# Altium schematic sheet PSU.SchDoc
size A4; DrawnBy: Jakov Sola; SheetNumber: 6; SheetTotal: 6
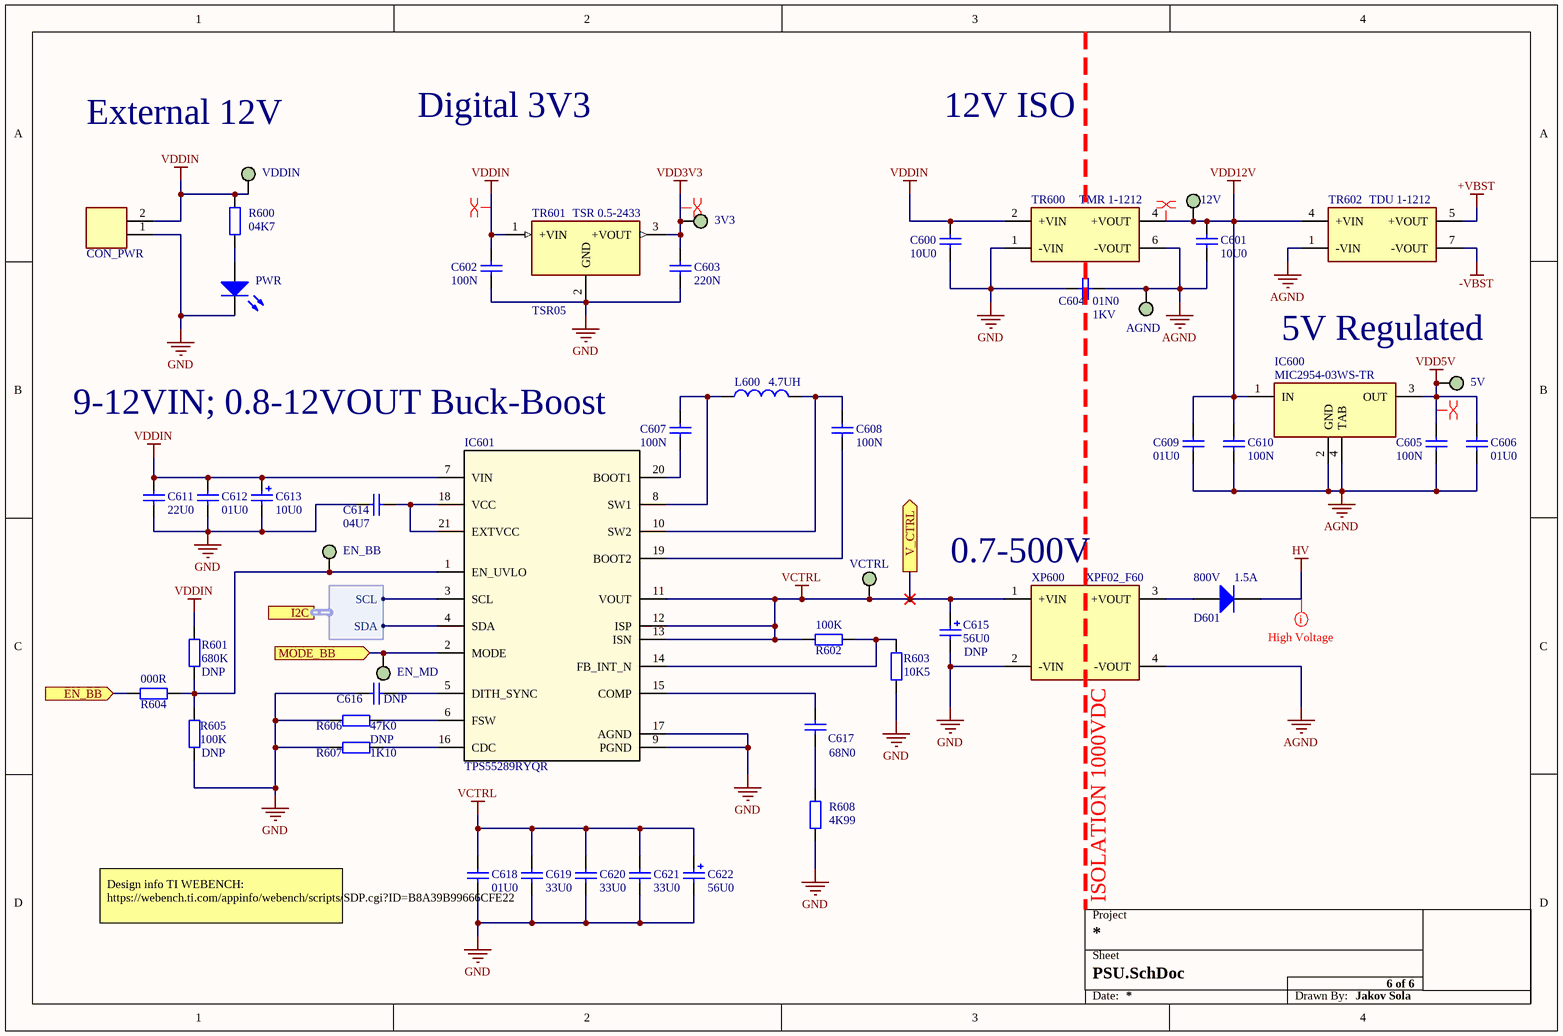
[diagram p0: PSU.SchDoc]

## Parts
3V3  TP  [TP]  (value not drawn)
5V  TP  [TP]  (value not drawn)
12V  TP  [TP]  (value not drawn)
AGND  TP  [TP]  (value not drawn)
C600  VALUE_4C: 10U0  [CAPC0603N]  (hidden comment: Cap)
C601  VALUE_4C: 10U0  [CAPC0603N]  (hidden comment: Cap)
C602  VALUE_4C: 100N  [CAPC0603N]  (hidden comment: Cap)
C603  VALUE_4C: 220N  [CAPC0603N]  (hidden comment: Cap)
C604  VALUE_4C: 01N0  VOLTAGE: 1KV  [CAPC1206N]  (hidden comment: Cap)
C605  VALUE_4C: 100N  [CAPC0603N]  (hidden comment: Cap)
C606  VALUE_4C: 01U0  [CAPC0603N]  (hidden comment: Cap)
C607  VALUE_4C: 100N  [CAPC0603N]  (hidden comment: Cap)
C608  VALUE_4C: 100N  [CAPC0603N]  (hidden comment: Cap)
C609  VALUE_4C: 01U0  [CAPC0603N]  (hidden comment: Cap)
C610  VALUE_4C: 100N  [CAPC0603N]  (hidden comment: Cap)
C611  VALUE_4C: 22U0  [CAPC1206N]  (hidden comment: Cap)
C612  VALUE_4C: 01U0  [CAPC0603N]  (hidden comment: Cap)
C613  VALUE_4C: 10U0  [C]  (hidden comment: CapPol)
C614  VALUE_4C: 04U7  [CAPC0603N]  (hidden comment: Cap)
C615  POPULATE: DNP  VALUE_4C: 56U0  [20SVPF56MX]  (hidden comment: CapPol)
C616  POPULATE: DNP  [CAPC0603N]  (hidden comment: Cap)
C617  VALUE_4C: 68N0  [CAPC0603N]  (hidden comment: Cap)
C618  VALUE_4C: 01U0  [CAPC0603N]  (hidden comment: Cap)
C619  VALUE_4C: 33U0  [CAPC1206N]  (hidden comment: Cap)
C620  VALUE_4C: 33U0  [CAPC1206N]  (hidden comment: Cap)
C621  VALUE_4C: 33U0  [CAPC1206N]  (hidden comment: Cap)
C622  VALUE_4C: 56U0  [20SVPF56MX]  (hidden comment: CapPol)
CON_PWR  CON_2P  [1711725]  (value not drawn)
D601  IF: 1.5A  VR: 800V  [DIOSMB]  (hidden comment: Diode)
EN_BB  TP  [TP]  (value not drawn)
EN_MD  TP  [TP]  (value not drawn)
IC600  MIC2954-03WS-TR  [SOT230P700X180-4N]
IC601  TPS55289RYQR  [RYQ0021A-MFG]
L600  INDUCTANCE: 4.7UH  [SRN80404R7Y]  (hidden comment: Inductor)
PWR  LED  [LED0603_GREEN]  (value not drawn)
R600  VALUE_4C: 04K7  [RESC0603N]  (hidden comment: Res)
R601  POPULATE: DNP  VALUE_4C: 680K  [RESC0603N]  (hidden comment: Res)
R602  VALUE_4C: 100K  [RESC0603N]  (hidden comment: Res)
R603  VALUE_4C: 10K5  [RESC0603N]  (hidden comment: Res)
R604  VALUE_4C: 000R  [RESC0603N]  (hidden comment: Res)
R605  POPULATE: DNP  VALUE_4C: 100K  [RESC0603N]  (hidden comment: Res)
R606  VALUE_4C: 47K0  [RESC0603N]  (hidden comment: Res)
R607  POPULATE: DNP  VALUE_4C: 1K10  [RESC0603N]  (hidden comment: Res)
R608  VALUE_4C: 4K99  [RESC0603N]  (hidden comment: Res)
TR600  MANUFCODE: TMR 1-1212  [TMR1]  (hidden comment: TMR1)
TR601  TSR05  MANUFCODE: TSR 0.5-2433  [TSR05]
TR602  MANUFCODE: TDU 1-1212  [TDU1]  (hidden comment: TDU1)
VCTRL  TP  [TP]  (value not drawn)
VDDIN  TP  [TP]  (value not drawn)
XP600  XPF02_F60  [XPF02_F60]

## Ports
EN_BB (in), I2C (harness I2C), MODE_BB (in), V_CTRL (out)

## Harnesses
I2C: SCL, SDA

## Nets
+VBST: TR602.5(+VOUT)
-VBST: TR602.7(-VOUT)
AGND: AGND.TP C601.1 C604.2 C605.1 C606.1 C609.1 C610.1 IC600.2(GND) IC600.4(TAB) TR600.6(-VOUT) TR602.1(-VIN) XP600.4(-VOUT)
GND: C600.1 C602.1 C603.1 C604.1 C611.1 C612.1 C613.2 C614.1 C615.2 C616.2 C618.1 C619.1 C620.1 C621.1 C622.2 CON_PWR.1 IC601.9(PGND) IC601.17(AGND) PWR.2(K) R603.2 R605.1 R606.2 R607.1 R608.1 TR600.1(-VIN) TR601.2(GND) XP600.2(-VIN)
HV: D601.2(K)
VCTRL: C615.1 C618.2 C619.2 C620.2 C621.2 C622.1 IC601.11(VOUT) IC601.12(ISP) IC601.13(ISN) R602.1 VCTRL.TP XP600.1(+VIN) ; port V_CTRL
VDD3V3: 3V3.TP C603.2 TR601.3(+VOUT)
VDD5V: 5V.TP C605.2 C606.2 IC600.3(OUT)
VDD12V: 12V.TP C601.2 C609.2 C610.2 IC600.1(IN) TR600.4(+VOUT) TR602.4(+VIN)
VDDIN: C600.2 C602.2 C611.2 C612.2 C613.1 CON_PWR.2 IC601.7(VIN) R600.2 R601.2 TR600.2(+VIN) TR601.1(+VIN) VDDIN.TP
EN_BB: R604.1 ; port EN_BB
MODE_BB: EN_MD.TP IC601.2(MODE) ; port MODE_BB
NetC607_1: C607.1 IC601.20(BOOT1)
NetC607_2: C607.2 IC601.8(SW1) L600.1
NetC608_1: C608.1 IC601.19(BOOT2)
NetC608_2: C608.2 IC601.10(SW2) L600.2
NetC614_2: C614.2 IC601.18(VCC) IC601.21(EXTVCC)
NetC616_1: C616.1 IC601.5(DITH_SYNC)
NetC617_1: C617.1 R608.2
NetC617_2: C617.2 IC601.15(COMP)
NetD601_1: D601.1(A) XP600.3(+VOUT)
NetEN_BB_TP: EN_BB.TP IC601.1(EN_UVLO) R601.1 R604.2 R605.2
NetIC601_3: IC601.3(SCL) ; port I2C.SCL
NetIC601_4: IC601.4(SDA) ; port I2C.SDA
NetIC601_6: IC601.6(FSW) R606.1
NetIC601_14: IC601.14(FB_INT_N) R602.2 R603.1
NetIC601_16: IC601.16(CDC) R607.2
NetPWR_1: PWR.1(A) R600.1

## Layout directives
mark named High Voltage: HV
rule Supply Nets [Voltage = 3.300]: VDD3V3, VDD5V
rule Supply Nets [Voltage = 12.00]: VDDIN
rule Supply Nets [Voltage = 5.000]: VDD12V

## Notes on the sheet
- External 12V
- Digital 3V3
- 12V ISO
- 5V Regulated
- 9-12VIN; 0.8-12VOUT Buck-Boost
- (near XP600) 0.7-500V
- Design info TI WEBENCH:
  https://webench.ti.com/appinfo/webench/scripts/SDP.cgi?ID=B8A39B99666CFE22
- (near XP600) ISOLATION 1000VDC
- Project
- Sheet
- Date:
- Drawn By:

## Library data of the parts
3V3 5V 12V AGND EN_BB EN_MD VCTRL VDDIN = TP: DESCR: TESTPOINT 1.5MM; POPULATE: NA; MANUFCODE: TP
C600 C601 = ZRB18AR61E106ME01L: MANUF: MURATA; DESCR: CAP 10U0 0603 25V X5R 20%; VENDOR: FARNELL INONE; VENDORCODE: 2469398; POPULATE: YES; VALUE_PF: 10000000; VALUE: 10U; VOLTAGE: 25V; TOLERANCE: 0.2; MANUFCODE: ZRB18AR61E106ME01L; PACKAGE: 0603; TECHNOLOGY: X5R
C602 C605 C607 C608 C610 = CL10B104KA8WPNC: MANUF: SAMSUNG; DESCR: CAP 100N 0603 25V X7R 10%; VENDOR: DIGI-KEY; VENDORCODE: 1276-6717-1-ND; POPULATE: YES; VALUE: 100N; VOLTAGE: 25V; TOLERANCE: 0.1; MANUFCODE: CL10B104KA8WPNC; PACKAGE: 0603; TECHNOLOGY: X7R
C603 = AC0603KRX7R6BB224: MANUF: YAGEO; DESCR: CAP 220N 0603 10V X7R 10%; VENDOR: DIGI-KEY; VENDORCODE: 311-3103-1-ND; POPULATE: YES; VALUE: 220N; VOLTAGE: 10V; TOLERANCE: 0.1; MANUFCODE: AC0603KRX7R6BB224; PACKAGE: 0603; TECHNOLOGY: X7R
C604 = 1206AC102KAT2A: MANUF: AVX; DESCR: CAP 01N0 1206 1KV X7R 10%; VENDOR: FARNELL INONE; VENDORCODE: 1216463; POPULATE: YES; VALUE_PF: 1000; TOLERANCE: 0.1; MANUFCODE: 1206AC102KAT2A; PACKAGE: 1206; TECHNOLOGY: X7R
C606 C609 = C0603C105K4PAC-TU: MANUF: KEMET; DESCR: CAP 01U0 0603 16V X5R 10%; VENDOR: FARNELL INONE; VENDORCODE: 1463388; POPULATE: YES; VALUE_PF: 1000000; VOLTAGE: 16V; TOLERANCE: 0.1; MANUFCODE: C0603C105K4PAC-TU; PACKAGE: 0603; TECHNOLOGY: X5R
C611 = CL31A226KAHNNNE: MANUF: SAMSUNG; DESCR: CAP 22U0 1206 25V X5R 10%; VENDOR: MOUSER; VENDORCODE: 187-CL31A226KAHNNNE; POPULATE: YES; VALUE_PF: 22000000; VALUE: 22U0; VOLTAGE: 25V; TOLERANCE: 0.1; MANUFCODE: CL31A226KAHNNNE; PACKAGE: 1206; TECHNOLOGY: X5R
C612 C618 = C0603C105K3PAC: MANUF: KEMET; DESCR: CAP 01U0 0603 25V X5R 10%; VENDOR: FARNELL INONE; VENDORCODE: 1288202; POPULATE: YES; VALUE_PF: 1000000; VOLTAGE: 25V; TOLERANCE: 0.1; MANUFCODE: C0603C105K3PAC; PACKAGE: 0603; TECHNOLOGY: X5R
C613 = TAJC106K025RNJ: MANUF: AVX; DESCR: CAP 10U0 C 25V TANT 10%; VENDOR: FARNELL INONE; VENDORCODE: 197518; POPULATE: YES; VALUE_PF: 10000000; VALUE: 10U; VOLTAGE: 25V; TOLERANCE: 0.1; MANUFCODE: TAJC106K025RNJ; PACKAGE: C; TECHNOLOGY: TANT
C614 = GRM185R61C475KE11D: MANUF: MURATA; DESCR: CAP 04U7 0603 16V X5R 10%; VENDOR: DIGI-KEY; VENDORCODE: 490-14459-1-ND; POPULATE: YES; VALUE_PF: 4700000; VALUE: 04U7; VOLTAGE: 16V; TOLERANCE: 0.1; MANUFCODE: GRM185R61C475KE11D; PACKAGE: 603; TECHNOLOGY: X5R
C615 = 20SVPF56MX: MANUF: PANASONIC; DESCR: CAP 56U0 5X5.9 20V 20%; VENDOR: MOUSER; VENDORCODE: 667-20SVPF56MX; VALUE_PF: 56000000; VALUE: 56U; VOLTAGE: 20V; TOLERANCE: 0.2; MANUFCODE: 20SVPF56MX; PACKAGE: 5X5.9
C616 = C0603C105K3PAC: MANUF: KEMET; DESCR: CAP 01U0 0603 25V X5R 10%; VENDOR: FARNELL INONE; VENDORCODE: 1288202; VALUE_PF: 1000000; VALUE_4C: 01U0; VOLTAGE: 25V; TOLERANCE: 0.1; MANUFCODE: C0603C105K3PAC; PACKAGE: 0603; TECHNOLOGY: X5R
C617 = C0603C683K8RACTU: MANUF: KEMET; DESCR: CAP 68N0 0603 10V X7R 10%; VENDOR: DIGI-KEY; VENDORCODE: 399-9122-1-ND; POPULATE: YES; VALUE: 68N; VOLTAGE: 10V; TOLERANCE: 0.1; MANUFCODE: C0603C683K8RACTU; PACKAGE: 0603; TECHNOLOGY: X7R
C619-C621 = C3216X5R1E336M160AC: MANUF: TDK; DESCR: CAP 33U0 1206 25V X5R 20%; VENDOR: MOUSER; VENDORCODE: 810-C3216X5R1E336M; POPULATE: YES; VALUE_PF: 33000000; VALUE: 33U; VOLTAGE: 25V; TOLERANCE: 0.2; MANUFCODE: C3216X5R1E336M160AC; PACKAGE: 1206; TECHNOLOGY: X5R
C622 = 20SVPF56MX: MANUF: PANASONIC; DESCR: CAP 56U0 5X5.9 20V 20%; VENDOR: MOUSER; VENDORCODE: 667-20SVPF56MX; POPULATE: YES; VALUE_PF: 56000000; VALUE: 56U; VOLTAGE: 20V; TOLERANCE: 0.2; MANUFCODE: 20SVPF56MX; PACKAGE: 5X5.9
CON_PWR = 1711725: MANUF: PHOENIX CONTACT; DESCR: CON PHOENIX 5.08MM 2P SCREW; VENDOR: MOUSER; VENDORCODE: 651-1711725; POPULATE: YES; MANUFCODE: 1711725
D601 = RS2K-E3/52T: Default Diode; MANUF: VISHAY; DESCR: DIODE 800V 1.5A SMB; VENDOR: MOUSER; VENDORCODE: 625-RS2K-E3; POPULATE: YES; MANUFCODE: RS2K-E3/52T; QTY: SINGLE; PACKAGE: SMB
IC600 = MIC2954-03WS-TR: MANUF: MICROCHIP; DESCR: IC LDO 2-30VIN 5VOUT 250mA; VENDOR: MOUSER; VENDORCODE: 998-MIC2954-03WSTR; POPULATE: YES; MANUFCODE: MIC2954-03WS-TR
IC601 = TPS55289RYQR: MANUF: TI; DESCR: IC BUCK-BOOST 30V 8A I2C; VENDOR: MOUSER; VENDORCODE: 595-TPS55289RYQR; POPULATE: YES; MANUFCODE: TPS55289RYQR
L600 = SRN8040-4R7Y: MANUF: BOURNS; DESCR: INDUCTOR 04U7 4A1 R024 SMD; VENDOR: MOUSER; VENDORCODE: 652-SRN8040-4R7Y; POPULATE: YES; VALUE: 04U7; IMAX: 4A1; RESISTANCE: R024; MANUFCODE: SRN8040-4R7Y; TYPE: INDUCTOR
PWR = ASMT-RF45: MANUF: AVAGO TECHNOLOGIES; DESCR: LED GREEN 0603 20MA 2.4V 60MCD; VENDOR: FARNELL INONE; VENDORCODE: 1652078; POPULATE: YES; REMARK: GREEN; IF: 20MA; VF: 2.4V; INTENSITY: 60MCD; MANUFCODE: ASMT-RF45; QTY: SINGLE; COLOR: GREEN; PACKAGE: 0603
R600 = CRCW06034K70JNEAC: Resistor; MANUF: VISHAY; DESCR: RES 04K7 0603 0.1W 5% 75V 200PPM; VENDOR: DIGI-KEY; VENDORCODE: 541-3993-1-ND; POPULATE: YES; VALUE_MOHM: 4700000; VALUE: 04K7; POWER: 0.1W; TOLERANCE: 5%; VOLTAGE: 75V; TEMPCOEFF: 200PPM; NPOWER: 0.1; NTOLERANCE: 0.05; NVOLTAGE: 75; NTEMPCOEFF: 200; MANUFCODE: CRCW06034K70JNEAC; PACKAGE: 0603; NVALUE: 4700000
R601 = CRCW0603680KFKEA: Resistor; MANUF: VISHAY; DESCR: RES 680K 0603 0.1W 1% 75V 100PPM; VENDOR: DIGI-KEY; VENDORCODE: 541-680KHCT-ND; VALUE_MOHM: 680000000; VALUE: 680K; POWER: 0.1W; TOLERANCE: 1%; VOLTAGE: 75V; TEMPCOEFF: 100PPM; NPOWER: 0.1; NTOLERANCE: 0.01; NVOLTAGE: 75; NTEMPCOEFF: 100; MANUFCODE: CRCW0603680KFKEA; PACKAGE: 0603; NVALUE: 680000000
R602 = MC 0.063W 0603 1% 100K: Resistor; MANUF: MULTICOMP; DESCR: RES 100K 0603 0.063W 1% 50V 100PPM; VENDOR: FARNELL INONE; VENDORCODE: 9330402; POPULATE: YES; VALUE_MOHM: 100000000; VALUE: 100K; POWER: 0.063W; TOLERANCE: 1%; VOLTAGE: 50V; TEMPCOEFF: 100PPM; NPOWER: 0.063; NTOLERANCE: 0.01; NVOLTAGE: 50; NTEMPCOEFF: 100; MANUFCODE: MC 0.063W 0603 1% 100K; PACKAGE: 0603; NVALUE: 100000000
R603 = MC0063W0603110K5: Resistor; MANUF: MULTICOMP; DESCR: RES 10K5 0603 0.063W 1% 50V 100PPM; VENDOR: FARNELL INONE; VENDORCODE: 2130940; POPULATE: YES; VALUE_MOHM: 10500000; VALUE: 10K5; POWER: 0.063W; TOLERANCE: 1%; VOLTAGE: 50V; TEMPCOEFF: 100PPM; NPOWER: 0.063; NTOLERANCE: 0.01; NVOLTAGE: 50; NTEMPCOEFF: 100; MANUFCODE: MC0063W0603110K5; PACKAGE: 0603; NVALUE: 10500000
R604 = CRCW06030000Z0EA: Resistor; MANUF: VISHAY; DESCR: RES 000R 0603 0.1W 1% 75V 100PPM; VENDOR: DIGI-KEY; VENDORCODE: 541-0.0GTR-ND; POPULATE: YES; VALUE_MOHM: 0; VALUE: 000R; POWER: 0.1W; TOLERANCE: 1%; VOLTAGE: 75V; TEMPCOEFF: 100PPM; NPOWER: 0.1; NTOLERANCE: 0.01; NVOLTAGE: 75; NTEMPCOEFF: 100; MANUFCODE: CRCW06030000Z0EA; PACKAGE: 0603; NVALUE: 0
R605 = MC 0.063W 0603 1% 100K: Resistor; MANUF: MULTICOMP; DESCR: RES 100K 0603 0.063W 1% 50V 100PPM; VENDOR: FARNELL INONE; VENDORCODE: 9330402; VALUE_MOHM: 100000000; VALUE: 100K; POWER: 0.063W; TOLERANCE: 1%; VOLTAGE: 50V; TEMPCOEFF: 100PPM; NPOWER: 0.063; NTOLERANCE: 0.01; NVOLTAGE: 50; NTEMPCOEFF: 100; MANUFCODE: MC 0.063W 0603 1% 100K; PACKAGE: 0603; NVALUE: 100000000
R606 = CRCW060347K0FKEA: Resistor; MANUF: VISHAY; DESCR: RES 47K0 0603 0.1W 1% 75V 100PPM; VENDOR: DIGI-KEY; VENDORCODE: 541-47.0KHCT-ND; POPULATE: YES; VALUE_MOHM: 47000000; VALUE: 47K; POWER: 0.1W; TOLERANCE: 1%; VOLTAGE: 75V; TEMPCOEFF: 100PPM; NPOWER: 0.1; NTOLERANCE: 0.01; NVOLTAGE: 75; NTEMPCOEFF: 100; MANUFCODE: CRCW060347K0FKEA; PACKAGE: 0603; NVALUE: 47000000
R607 = CRCW06031K10FKEA: Resistor; MANUF: VISHAY; DESCR: RES 1K10 0603 0.1W 1% 75V 100PPM; VENDOR: DIGI-KEY; VENDORCODE: 541-1.10KHCT-ND; VALUE_MOHM: 1100000; VALUE: 1K1; POWER: 0.1W; TOLERANCE: 1%; VOLTAGE: 75V; TEMPCOEFF: 100PPM; NPOWER: 0.1; NTOLERANCE: 0.01; NVOLTAGE: 75; NTEMPCOEFF: 100; MANUFCODE: CRCW06031K10FKEA; PACKAGE: 0603; NVALUE: 1100000
R608 = MC 0.063W 0603 1% 4K99: Resistor; MANUF: MULTICOMP; DESCR: RES 4K99 0603 0.1W 1% 50V 100PPM; VENDOR: FARNELL INONE; VENDORCODE: 1170859; POPULATE: YES; VALUE_MOHM: 4990000; VALUE: 4K99; POWER: 0.063W; TOLERANCE: 1%; VOLTAGE: 50V; TEMPCOEFF: 100PPM; NPOWER: 0.063; NTOLERANCE: 0.01; NVOLTAGE: 50; NTEMPCOEFF: 100; MANUFCODE: MC 0.063W 0603 1% 4K99; PACKAGE: 0603; NVALUE: 4990000
TR600 = TMR 1-1212: MANUF: TRACO; DESCR: IC TR 9-18 VIN 12 VOUT REG ISO 1W; VENDOR: MOUSER; VENDORCODE: 495-TMR1-1212; POPULATE: YES
TR601 = TSR 0.5-2433: MANUF: TRACO; DESCR: IC TR 4.75-32 VIN 3.3 VOUT 0.5A; VENDOR: MOUSER; VENDORCODE: 495-TSR0.5-2433; POPULATE: YES
TR602 = TDU 1-1212: MANUF: TRACO; DESCR: IC TR 10.8-13.2 VIN 12 VOUT ISO 1W; VENDOR: MOUSER; VENDORCODE: 495-TDU1-1212; POPULATE: YES
XP600 = F05: MANUFCODE: F05; MANUF: XP POWER; DESCR: IC DCDC 0.8-12VIN 0-500 VOUT 10W; VENDOR: MOUSER; VENDORCODE: 209-F05; POPULATE: YES